# EAGLE design shape_setting_arduino_board (EAGLE 9.1.1)
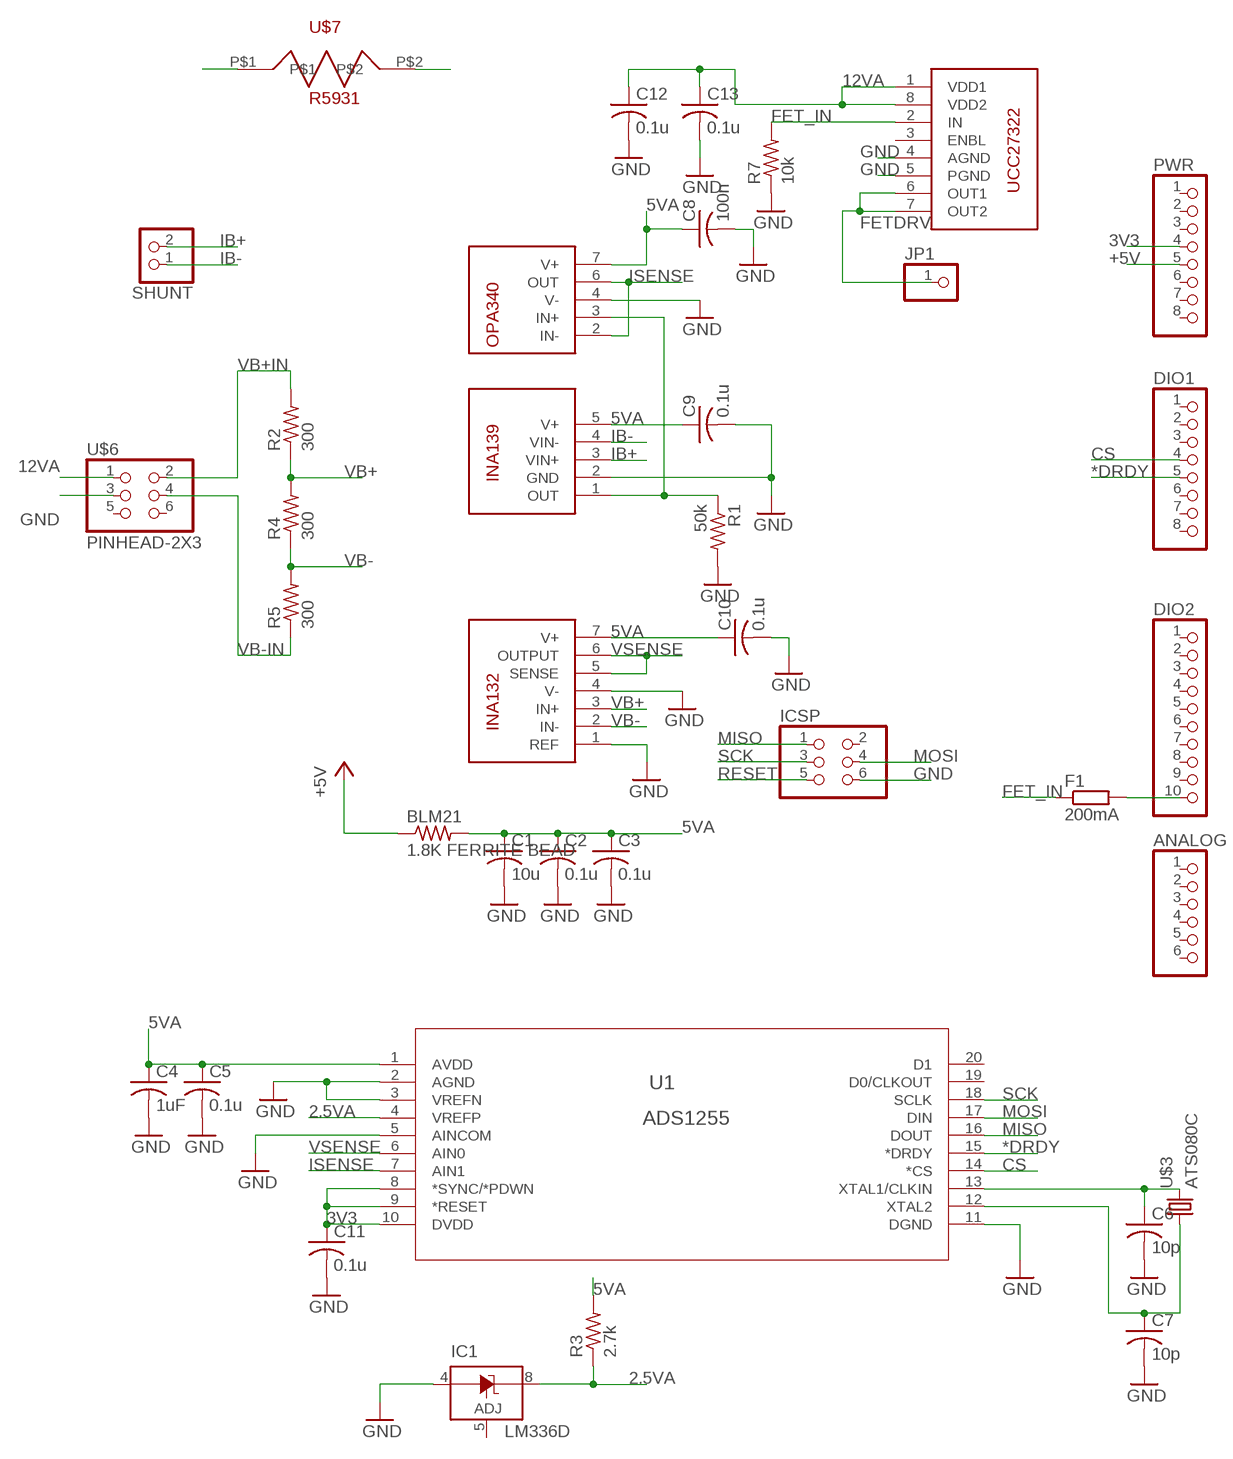
[diagram p0: schematic, sheet 1]

## Parts
ANALOG  PINHD-1X6  [1X06]
BLM21  1.8K FERRITE BEAD  R-US_R0805  [R0805]
C1  10u  C-USC0805  [C0805]
C2  0.1u  C-USC0603  [C0603]
C3  0.1u  C-USC0603  [C0603]
C4  1uF  C-USC0805  [C0805]
C5  0.1u  C-USC0603  [C0603]
C6  10p  C-USC0603  [C0603]
C7  10p  C-USC0603  [C0603]
C8  100n  C-USC0603  [C0603]
C9  0.1u  C-USC0603  [C0603]
C10  0.1u  C-USC0603  [C0603]
C11  0.1u  C-USC0603  [C0603]
C12  0.1u  C-USC0603  [C0603]
C13  0.1u  C-USC0603  [C0603]
DIO1  PINHD-1X8  [1X08]
DIO2  PINHD-1X10  [1X10]
F1  200mA  R-EU_R0603  [R0603]
IC1  LM336D  [SO08]
ICSP  PINHD-2X3  [2X03]
JP1  PINHD-1X1  [1X01]
PWR  PINHD-1X8  [1X08]
R1  50k  R-US_R0603  [R0603]
R2  300  R-US_R0603  [R0603]
R3  2.7k  R-US_R0603  [R0603]
R4  300  R-US_R0603  [R0603]
R5  300  R-US_R0603  [R0603]
R7  10k  R-US_R0603  [R0603]
SHUNT  PINHD-1X2  [1X02]
U1  ADS1255  ADS1255_DB_20  [DB20]
U$1  INA139  [SOT-23(DBV)]
U$2  INA132U  [8SOIC(D)]
U$3  ATS080C  [ATS]
U$4  OPA340  [8SOIC(D)]
U$5  UCC27322  [8SOIC(D)]
U$6  PINHEAD-2X3  [2X03]
U$7  R5931  [5931]

## Nets
2.5VA: IC1.8(C) R3.1 U1.4(VREFP)
3V3: C11.1 PWR.4 U1.8(*SYNC/*PDWN) U1.9(*RESET) U1.10(DVDD)
5VA: BLM21.2 C1.1 C2.1 C3.1 C4.1 C5.1 C8.1 C9.1 C10.1 R3.2 U1.1(AVDD) U$1.5(V+) U$2.7(V+) U$4.7(V+)
12VA: C12.1 C13.1 U$5.1(VDD1) U$5.8(VDD2) U$6.1
*DRDY: DIO1.5 U1.15(*DRDY)
+5V: BLM21.1 PWR.5
CS: DIO1.4 U1.14(*CS)
FET_IN: F1.1 R7.2 U$5.2(IN)
FETDRV: JP1.1 U$5.6(OUT1) U$5.7(OUT2)
GND: C1.2 C2.2 C3.2 C4.2 C5.2 C6.2 C7.2 C8.2 C9.2 C10.2 C11.2 C12.2 C13.2 IC1.4(A) ICSP.6 R1.2 R7.1 U1.2(AGND) U1.3(VREFN) U1.5(AINCOM) U1.11(DGND) U$1.2(GND) U$2.1(REF) U$2.4(V-) U$4.4(V-) U$5.4(AGND) U$5.5(PGND) U$6.3
IB+: SHUNT.2 U$1.3(VIN+)
IB-: SHUNT.1 U$1.4(VIN-)
ISENSE: U1.7(AIN1) U$4.2(IN-) U$4.6(OUT)
MISO: ICSP.1 U1.16(DOUT)
MOSI: ICSP.4 U1.17(DIN)
N$1: R1.1 U$1.1(OUT) U$4.3(IN+)
N$2: C6.1 U1.13(XTAL1/CLKIN) U$3.2
N$3: C7.1 U1.12(XTAL2) U$3.1
N$4: DIO2.10 F1.2
RESET: ICSP.5
SCK: ICSP.3 U1.18(SCLK)
SENSE+: U$7.P$2
SENSE-: U$7.P$1
VB+: R2.1 R4.2 U$2.3(IN+)
VB+IN: R2.2 U$6.2
VB-: R4.1 R5.2 U$2.2(IN-)
VB-IN: R5.1 U$6.4
VSENSE: U1.6(AIN0) U$2.5(SENSE) U$2.6(OUTPUT)
Unconnected: ANALOG.1 ANALOG.2 ANALOG.3 ANALOG.4 ANALOG.5 ANALOG.6 DIO1.1 DIO1.2 DIO1.3 DIO1.6 DIO1.7 DIO1.8 DIO2.1 DIO2.2 DIO2.3 DIO2.4 DIO2.5 DIO2.6 DIO2.7 DIO2.8 DIO2.9 IC1.5(ADJ) ICSP.2 PWR.1 PWR.2 PWR.3 PWR.6 PWR.7 PWR.8 U1.19(D0/CLKOUT) U1.20(D1) U$5.3(ENBL) U$6.5 U$6.6

## Library data of the parts
ANALOG = pinhead:PINHD-1X6: PIN HEADER
BLM21 R1-R5 R7 = resistor:R-US_: RESISTOR, American symbol
C1-C13 = resistor:C-US: CAPACITOR, American symbol
DIO1 PWR = pinhead:PINHD-1X8: PIN HEADER
DIO2 = pinhead:PINHD-1X10: PIN HEADER
F1 = rcl:R-EU_: RESISTOR, European symbol; SPICEPREFIX: R
IC1 = linear:LM336: 2.5-V INTEGRATED REFERENCE CIRCUITS LM236 Source: http://focus.ti.com/lit/ds/symlink/lm336-2.5.pdf
ICSP = pinhead:PINHD-2X3: PIN HEADER
JP1 = pinhead:PINHD-1X1: PIN HEADER
SHUNT = pinhead:PINHD-1X2: PIN HEADER
U1 = texas_parts:ADS1255_DB_20; DATASHEETURL: http://www.ti.com/lit/gpn/ADS1255; DESCRIPTION: 24 Bit, 30kSPS Very Low Noise Delta-Sigma ADC; FAMILY_NAME: PRECISION ADC (<=10MSPS); GENERIC_PART_NUMBER: ADS1255; INDUSTRY_STD_PKG_TYPE: SSOP; MANUFACTURER: Texas Instruments; PACKAGE_DESIGNATOR: DB; PIN_COUNT: 20
U$1 = texas_parts:INA139
U$2 = texas_parts:INA132U
U$3 = crystal:ATS080C
U$4 = texas_parts:OPA340
U$5 = texas_parts:UCC27322
U$6 = pinheaders_shrouded:PINHEAD-2X3
U$7 = sense_resistors:R5931

## Board
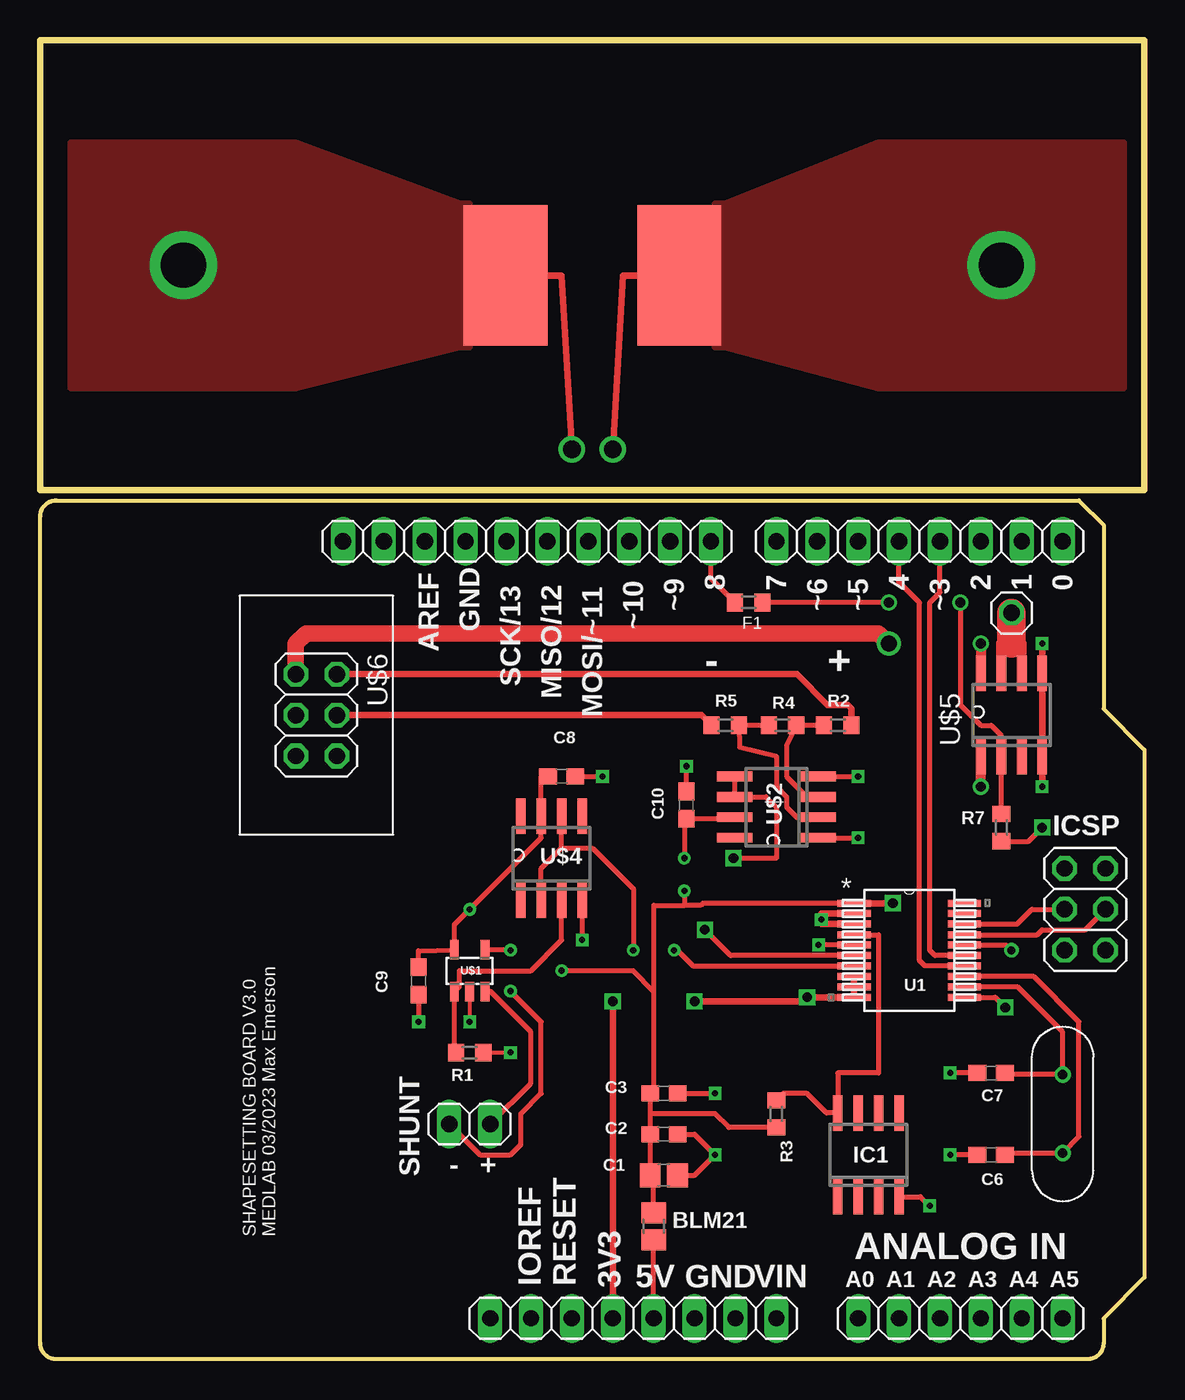
[diagram p1: board, top side]
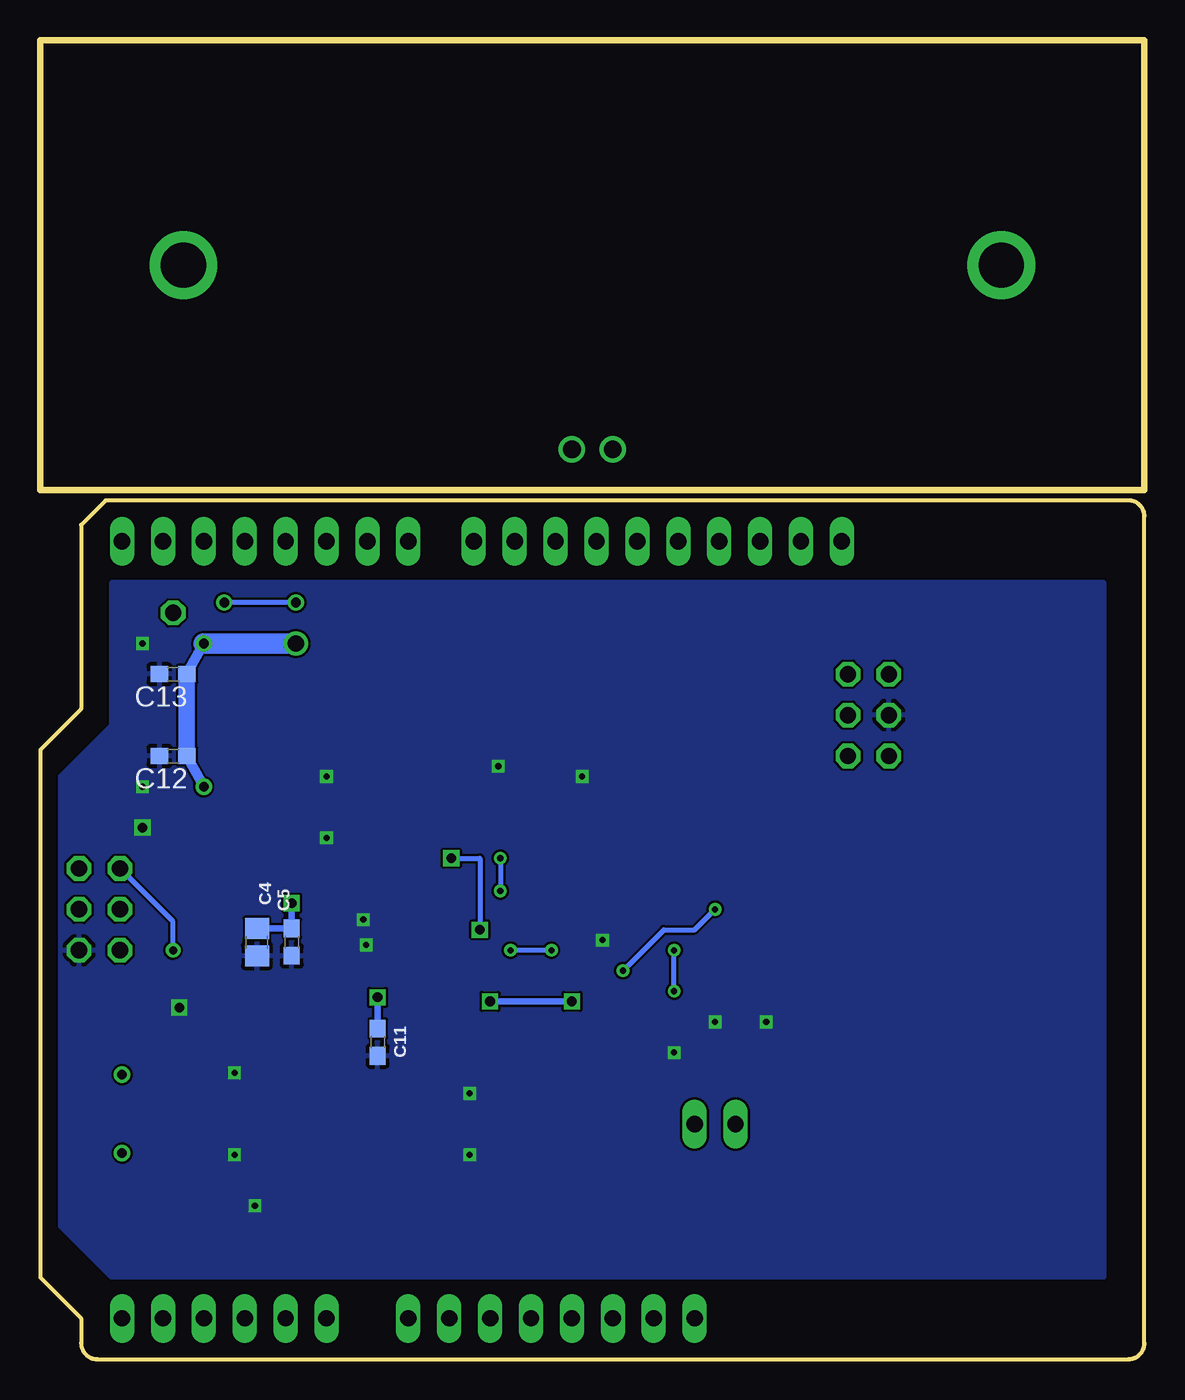
[diagram p2: board, bottom side, seen from below]

Size 68.58 x 81.92 mm. Coordinates in mm from the lower left corner, seen from the top.
Outline: 64.52,53.34 66.04,51.82 66.04,40.39 68.58,37.85 68.58,5.08 66.04,2.54 66.04,1 arc-90 65.04,0 1,0 arc-90 0,1 0,52.34 arc-90 1,53.34 64.52,53.34
Outline: 0,53.98 0,81.92 68.58,81.92 68.58,53.98 0,53.98
Copper layers (1*16): Top 0.0178mm / dielectric 59mil / Bottom 0.0178mm
Design rules "SSC-EAGLE-2Lyr_v1.0.0.3": minimum track width 6mil, minimum drill 14mil, track to track 6mil, track to pad 6mil, pad to pad 6mil, via to via 6mil, smd to smd 6mil, copper to edge 20mil, drill to drill 16mil, minimum pad ring 8mil, minimum via ring 8mil, stop-mask expansion 3mil, vias tented up to drill 0mil, thermal gap 10mil

### Footprints (pad centres in the part's own frame; a part is rotated, then mirrored left to right if it is on the bottom)
1X06 = drill 1.016 long: 1 -6.35,0; 2 -3.81,0; 3 -1.27,0; 4 1.27,0; 5 3.81,0; 6 6.35,0
R0805 = smd 1.3 x 1.5: 1 -0.85,0; 2 0.85,0
C0805 = smd 1.3 x 1.5: 1 -0.85,0; 2 0.85,0
C0603 = smd 1.1 x 1: 1 -0.85,0; 2 0.85,0
1X08 = drill 1.016 long: 1 -8.89,0; 2 -6.35,0; 3 -3.81,0; 4 -1.27,0; 5 1.27,0; 6 3.81,0; 7 6.35,0; 8 8.89,0
1X10 = drill 1.016 long: 1 -11.43,0; 2 -8.89,0; 3 -6.35,0; 4 -3.81,0; 5 -1.27,0; 6 1.27,0; 7 3.81,0; 8 6.35,0; 9 8.89,0; 10 11.43,0
R0603 = smd 1 x 1.1: 1 -0.85,0; 2 0.85,0
SO08 = smd 0.6 x 2.2: 1 -1.905,-2.6; 2 -0.635,-2.6; 3 0.635,-2.6; 4 1.905,-2.6; 5 1.905,2.6; 6 0.635,2.6; 7 -0.635,2.6; 8 -1.905,2.6
2X03 = drill 1.016 octagon: 1 -2.54,-1.27; 2 -2.54,1.27; 3 0,-1.27; 4 0,1.27; 5 2.54,-1.27; 6 2.54,1.27
1X01 = drill 1.016 octagon: 1 0,0
1X02 = drill 1.016 long: 1 -1.27,0; 2 1.27,0
DB20 = smd 2.057 x 0.432: 1 -3.429,2.921; 2 -3.429,2.286; 3 -3.429,1.626; 4 -3.429,0.965; 5 -3.429,0.33; 6 -3.429,-0.33; 7 -3.429,-0.965; 8 -3.429,-1.626; 9 -3.429,-2.286; 10 -3.429,-2.921; 11 3.429,-2.921; 12 3.429,-2.286; 13 3.429,-1.626; 14 3.429,-0.965; 15 3.429,-0.33; 16 3.429,0.33; 17 3.429,0.965; 18 3.429,1.626; 19 3.429,2.286; 20 3.429,2.921
SOT-23(DBV) = smd 0.55 x 1.2: 1 -0.95,-1.3; 2 0,-1.3; 3 0.95,-1.3; 4 0.95,1.3; 5 -0.95,1.3
8SOIC(D) = smd 0.6 x 2.2: 1 -1.905,-2.6; 2 -0.635,-2.6; 3 0.635,-2.6; 4 1.905,-2.6; 5 1.905,2.6; 6 0.635,2.6; 7 -0.635,2.6; 8 -1.905,2.6
ATS = drill 0.6: 1 2.438,0; 2 -2.438,0
5931 = smd 5.207 x 8.738: P$1 -5.397,0; P$2 5.397,0

### Placement (x,y rotation side)
ANALOG  57.15,2.54 0 top
BLM21  38.1,8.26 90 top
C1  38.73,11.43 0 top
C2  38.73,13.97 0 top
C3  38.73,16.51 0 top
C4  55.12,25.91 270 bottom
C5  52.96,25.91 270 bottom
C6  59.05,12.7 180 top
C7  59.05,17.78 180 top
C8  32.38,36.2 0 top
C9  23.5,23.5 270 top
C10  40.13,34.42 90 top
C11  47.62,19.68 270 bottom
C12  60.33,37.47 180 bottom
C13  60.33,42.55 180 bottom
DIO1  54.61,50.8 0 top
DIO2  30.23,50.8 0 top
F1  44,47 180 top
IC1  51.44,12.7 0 top
ICSP  64.9,27.94 270 top
JP1  60.33,46.35 0 top
PWR  36.83,2.54 0 top
R1  26.67,19.05 0 top
R2  49.53,39.37 0 top
R3  45.72,15.24 270 top
R4  46.1,39.37 0 top
R5  42.55,39.37 0 top
R7  59.69,33.02 90 top
SHUNT  26.67,14.61 0 top
U1  53.98,25.4 0 top
U$1  26.67,24.13 0 top
U$2  45.72,34.29 90 top
U$3  63.5,15.24 90 top
U$4  31.75,31.11 0 top
U$5  60.33,40.01 0 top
U$6  17.14,40.01 270 top
U$7  34.29,67.31 0 top

### Tracks (layer width: path | path; a pad name or v marks a point on that pad's centre or on a via)
2.5VA
  Top 0.305: R3.1 46.14,16.51 47.62,16.51 48.84,15.3 IC1.8 49.53,17.78 52.07,17.78 52.07,26.36 U1.4
3V3  (via drill 0.6)
  Top 0.406: PWR.4 v35.56,22.23 | v40.64,22.23 47.37,22.23 v47.62,22.48 U1.10 U1.9 U1.8
  Bottom 0.406: 47.37,22.23 v47.62,22.48 C11.1 | v35.56,22.23 v40.64,22.23
5VA  (via drill 0.38, 0.6)
  Top 0.305: BLM21.2 38.1,11.21 C1.1 C2.1 37.88,15.24 | 37.88,15.24 C3.1 38.1,16.73 38.1,22.86 | R3.2 42.76,14.39 41.91,15.24 37.88,15.24 | 40.01,28.19 38.1,28.19 38.1,22.86 | C9.1 23.49,25.36 U$1.5 25.72,26.99 v26.67,27.94 31.11,32.38 U$4.7 31.11,36.2 C8.1 | U$2.7 43.12,33.57 C10.1 40.01,33.57 v40.01,31.11 | v40.01,29.08 40.01,28.19 | 38.1,22.86 36.83,24.13 v32.38,24.13 | U1.1 41.15,28.32 41.02,28.19 40.01,28.19
  Top 0.406: v52.96,28.32 U1.1
  Bottom 0.305: v40.01,31.11 v40.01,29.08 | v32.38,24.13 29.84,26.67 27.94,26.67 v26.67,27.94
  Bottom 0.406: C4.1 C5.1 v52.96,28.32
12VA  (via drill 0.6, 1)
  Top 0.61: v58.42,44.45 U$5.8 | v58.42,35.56 U$5.1
  Top 1.016: U$6.1 15.88,44.45 16.51,45.09 52.07,45.09 v52.7,44.45
  Bottom 0.61: C13.1 v58.42,44.45 | C12.1 v58.42,35.56
  Bottom 1.016: C13.1 C12.1
  Bottom 1.27: v52.7,44.45 v58.42,44.45
*DRDY
  Top 0.305: U1.15 55.58,25.07 55.24,25.4 55.24,46.99 55.88,47.62 DIO1.5
+5V
  Top 0.305: PWR.5 BLM21.1
CS
  Top 0.305: U1.14 54.94,24.43 54.61,24.77 54.61,46.99 53.34,48.26 DIO1.4
FET_IN  (via drill 0.6)
  Top 0.305: v57.15,46.99 57.15,40.64 58.42,39.37 59.05,39.37 59.69,38.73 U$5.2 R7.2 | v52.7,46.99 F1.1
  Bottom 0.305: v52.7,46.99 v57.15,46.99
FETDRV
  Top 0.406: 59.69,44.45 60.33,44.45 60.96,44.45
  Top 0.61: U$5.7 59.69,44.45 | U$5.6 60.96,44.45
  Top 1.778: JP1.1 60.33,44.45
GND  (via drill 0.38, 0.6)
  Top 0.254: R1.2 v29.21,19.05 | U$1.2 v26.67,20.95
  Top 0.305: U$2.4 v50.8,36.2 | U$4.4 v33.66,26.04 | C3.2 v41.91,16.51 | C2.2 40.64,13.97 v41.91,12.7 40.64,11.43 C1.2 | IC1.4 54.67,10.1 v55.24,9.53 | U1.5 v48.34,25.73 | C7.2 v56.52,17.78 | C6.2 v56.52,12.7 | U1.11 59.31,22.48 v59.94,21.84 | C8.2 v34.92,36.2 | C10.2 v40.13,36.83 | U$2.1 v50.8,32.38 | C9.2 v23.5,20.95 | R7.1 61.38,32.17 v62.23,33.02
  Top 0.406: U1.2 48.51,27.69 v48.51,27.3 48.51,27.03 U1.3 | v62.23,35.56 U$5.4 U$5.5 v62.23,44.45
  pour Bottom: 2.54,5.08 64.14,5.08 67.31,8.26 67.31,36.2 64.14,39.37 64.14,48.26 2.54,48.26
IB+
  Top 0.305: SHUNT.2 30.48,17.14 30.48,20.32 27.97,22.83 U$1.3
IB-  (via drill 0.38)
  Top 0.305: SHUNT.1 27.3,12.7 29.21,12.7 29.84,13.34 29.84,15.24 31.11,16.51 31.11,20.95 v29.21,22.86 | v29.21,25.4 29.18,25.43 U$1.4
  Bottom 0.305: v29.21,22.86 v29.21,25.4
ISENSE  (via drill 0.38)
  Top 0.305: 32.38,31.75 U$4.6 | U$4.2 31.11,30.48 32.38,31.75 | 32.38,31.75 34.29,31.75 36.83,29.21 v36.83,25.4 | v39.37,25.4 39.57,25.4 40.54,24.43 U1.7
  Bottom 0.305: v36.83,25.4 v39.37,25.4
MISO  (via drill 0.5)
  Top 0.305: U1.16 59.99,25.73 v60.33,25.4
  Bottom 0.305: v60.33,25.4 60.33,27.18 ICSP.1
MOSI
  Top 0.305: U1.17 61.92,26.36 62.23,26.67 64.9,26.67 ICSP.4
N$1
  Top 0.305: R1.1 25.72,19.05 U$1.1 26.04,23.14 26.04,24.13 30.48,24.13 32.38,26.04 U$4.3
N$2
  Top 0.305: C6.1 60.01,12.8 U$3.2 64.52,13.82 64.52,20.95 61.7,23.77 U1.13
N$3
  Top 0.305: C7.1 60.01,17.68 U$3.1 63.5,20.32 60.71,23.11 U1.12
N$4
  Top 0.305: F1.2 41.66,48.49 DIO2.10
SCK
  Top 0.305: U1.18 60.68,27.03 61.59,27.94 ICSP.3
SENSE+  (via drill 1.1, 2.8)
  Top 0.406: v35.56,56.52 36.2,67.31 U$7.P$2
  other vias: 59.69,67.94
  pour Top (no thermals): 41.91,71.75 42.55,71.75 52.07,75.56 67.31,75.56 67.31,60.33 52.07,60.33 42.55,62.87 41.91,62.87
SENSE-  (via drill 1.1, 2.8)
  Top 0.406: v33.02,56.52 32.38,67.31 U$7.P$1
  other vias: 8.89,67.94
  pour Top (no thermals): 26.04,71.75 15.88,75.56 1.91,75.56 1.91,60.33 15.88,60.33 26.04,62.87 26.67,62.87 26.67,71.75
VB+
  Top 0.305: R2.1 R4.2 46.35,38.1 46.35,36.2 47.62,34.92 U$2.3
VB+IN
  Top 0.406: R2.2 50.38,40.42 50.16,40.64 48.9,40.64 46.99,42.55 U$6.2
VB-
  Top 0.305: R4.1 R5.2 43.43,38.01 45.72,37.47 45.72,35.56 46.35,34.92 46.35,34.29 46.99,33.66 U$2.2
VB-IN
  Top 0.406: U$6.4 41.06,40.01 R5.1
VSENSE  (via drill 0.6)
  Top 0.305: U$2.5 U$2.6 45.09,34.92 45.72,34.29 45.72,31.11 v43.05,31.11 | U1.6 42.88,25.07 v41.27,26.67
  Bottom 0.305: v43.05,31.11 41.27,31.11 v41.27,26.67

### Text on the board
tPlace: + | - | +
tNames: 8 | 7 | 4 | 2 | 1 | 0 | ~9 | ~6 | ~5 | ~3 | GND | ~10 | AREF | - | SCK/13 | MISO/12 | MOSI/~11 | SHAPESETTING BOARD V3.0 / MEDLAB 03/2023 Max Emerson | ANALOG IN | IOREF | RESET | 3V3 | 5V | GND | VIN | A0 | A1 | A2 | A3 | A4 | A5